# Altium schematic sheet STM32F103VE.SchDoc
size A4
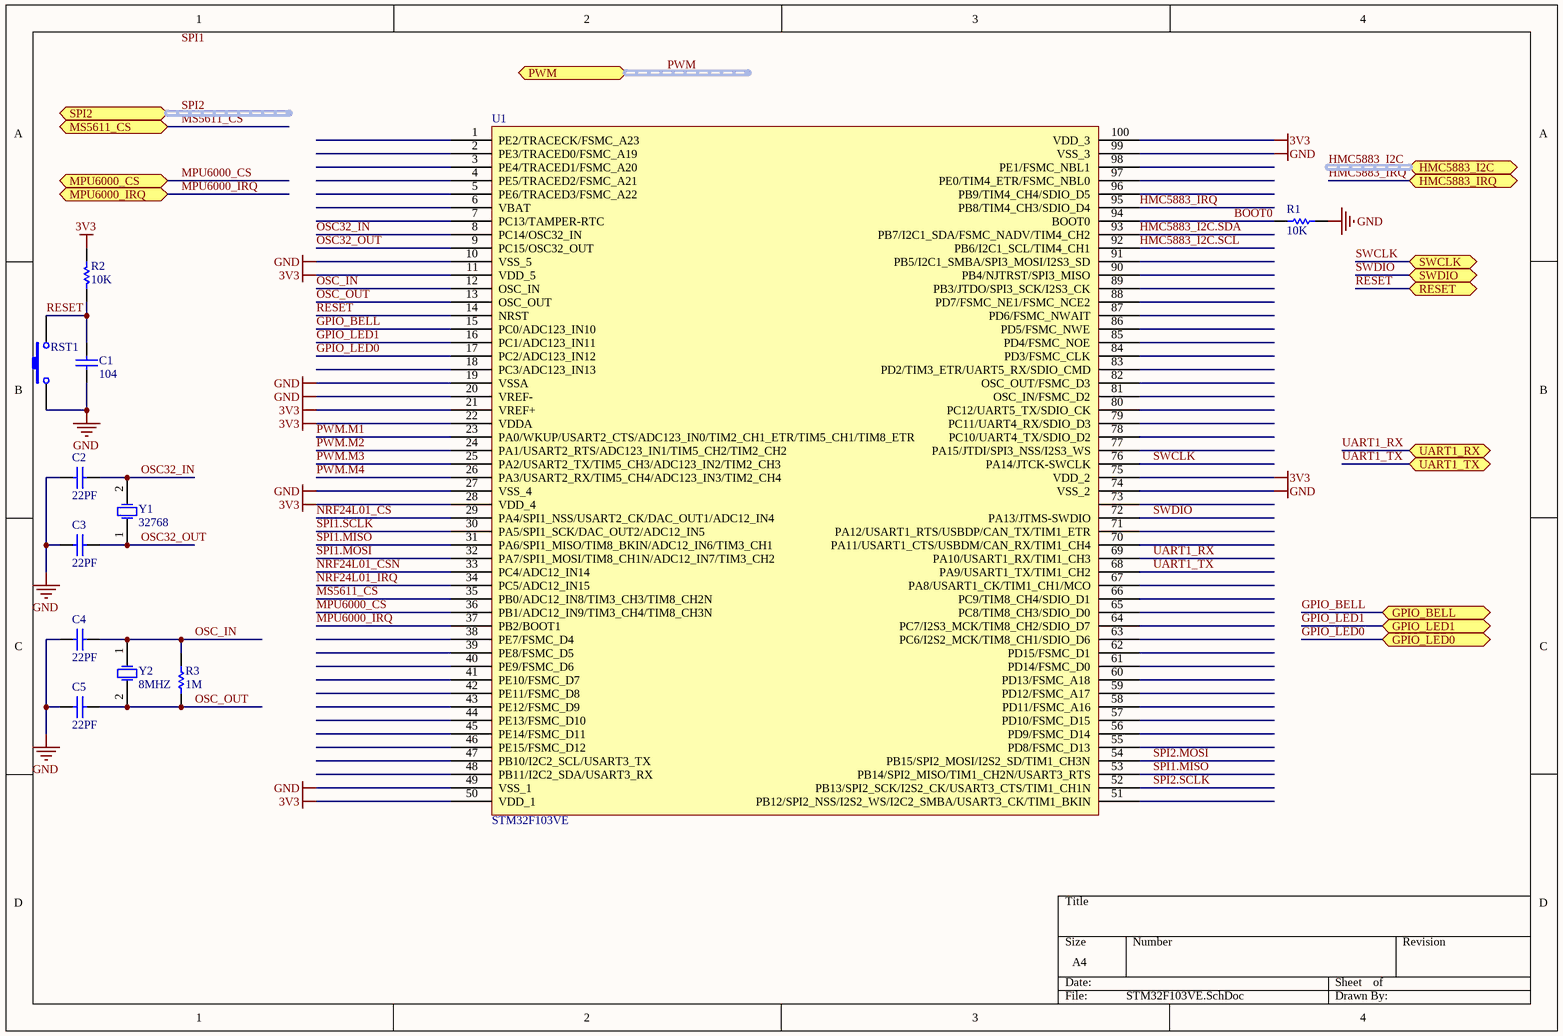
[diagram p0: STM32F103VE.SchDoc]

## Parts
C1  value 104  [RC0805]  (hidden comment: Cap)
C2  value 22PF  [RC0805]  (hidden comment: Cap)
C3  value 22PF  [RC0805]  (hidden comment: Cap)
C4  value 22PF  [RC0805]  (hidden comment: Cap)
C5  value 22PF  [RC0805]  (hidden comment: Cap)
R1  value 10K  [RC0805]  (hidden comment: Res1)
R2  value 10K  [RC0805]  (hidden comment: Res1)
R3  value 1M  [RC0805]  (hidden comment: Res1)
RST1  SW-PB  [KEY2*2(COMMON)]  (value not drawn)
U1  STM32F103VE
Y1  32768  [XTAL32]
Y2  8MHZ  [OSC]

## Ports
GPIO_BELL, GPIO_LED0, GPIO_LED1, HMC5883_I2C (harness HMC5883_I2C), HMC5883_IRQ, MPU6000_CS, MPU6000_IRQ, MS5611_CS, PWM (harness PWM), RESET, SPI2 (harness SPI2), SWCLK, SWDIO, UART1_RX, UART1_TX

## Nets
3V3: R2.2 U1.11(VDD_5) U1.21(VREF+) U1.22(VDDA) U1.28(VDD_4) U1.50(VDD_1) U1.75(VDD_2) U1.100(VDD_3)
GND: C1.2 C2.1 C3.1 C4.1 C5.1 R1.1 RST1.2 U1.10(VSS_5) U1.19(VSSA) U1.20(VREF-) U1.27(VSS_4) U1.49(VSS_1) U1.74(VSS_2) U1.99(VSS_3)
BOOT0: R1.2 U1.94(BOOT0)
GPIO_BELL: U1.15(PC0/ADC123_IN10) ; port GPIO_BELL
GPIO_LED0: U1.17(PC2/ADC123_IN12) ; port GPIO_LED0
GPIO_LED1: U1.16(PC1/ADC123_IN11) ; port GPIO_LED1
HMC5883_I2C.SCL: U1.92(PB6/I2C1_SCL/TIM4_CH1)
HMC5883_I2C.SDA: U1.93(PB7/I2C1_SDA/FSMC_NADV/TIM4_CH2)
HMC5883_IRQ: U1.95(PB8/TIM4_CH3/SDIO_D4) ; port HMC5883_IRQ
MPU6000_CS: U1.36(PB1/ADC12_IN9/TIM3_CH4/TIM8_CH3N) ; port MPU6000_CS
MPU6000_IRQ: U1.37(PB2/BOOT1) ; port MPU6000_IRQ
MS5611_CS: U1.35(PB0/ADC12_IN8/TIM3_CH3/TIM8_CH2N) ; port MS5611_CS
NRF24L01_CS: U1.29(PA4/SPI1_NSS/USART2_CK/DAC_OUT1/ADC12_IN4)
NRF24L01_CSN: U1.33(PC4/ADC12_IN14)
NRF24L01_IRQ: U1.34(PC5/ADC12_IN15)
OSC32_IN: C2.2 U1.8(PC14/OSC32_IN) Y1.2(OSC2)
OSC32_OUT: C3.2 U1.9(PC15/OSC32_OUT) Y1.1(OSC1)
OSC_IN: C4.2 R3.2 U1.12(OSC_IN) Y2.1(OSC1)
OSC_OUT: C5.2 R3.1 U1.13(OSC_OUT) Y2.2(OSC2)
PWM.M1: U1.23(PA0/WKUP/USART2_CTS/ADC123_IN0/TIM2_CH1_ETR/TIM5_CH1/TIM8_ETR)
PWM.M2: U1.24(PA1/USART2_RTS/ADC123_IN1/TIM5_CH2/TIM2_CH2)
PWM.M3: U1.25(PA2/USART2_TX/TIM5_CH3/ADC123_IN2/TIM2_CH3)
PWM.M4: U1.26(PA3/USART2_RX/TIM5_CH4/ADC123_IN3/TIM2_CH4)
RESET: C1.1 R2.1 RST1.1 U1.14(NRST) ; port RESET
SPI1.MISO: U1.31(PA6/SPI1_MISO/TIM8_BKIN/ADC12_IN6/TIM3_CH1) U1.53(PB14/SPI2_MISO/TIM1_CH2N/USART3_RTS)
SPI1.MOSI: U1.32(PA7/SPI1_MOSI/TIM8_CH1N/ADC12_IN7/TIM3_CH2)
SPI1.SCLK: U1.30(PA5/SPI1_SCK/DAC_OUT2/ADC12_IN5)
SPI2.MOSI: U1.54(PB15/SPI2_MOSI/I2S2_SD/TIM1_CH3N)
SPI2.SCLK: U1.52(PB13/SPI2_SCK/I2S2_CK/USART3_CTS/TIM1_CH1N)
SWCLK: U1.76(PA14/JTCK-SWCLK) ; port SWCLK
SWDIO: U1.72(PA13/JTMS-SWDIO) ; port SWDIO
UART1_RX: U1.69(PA10/USART1_RX/TIM1_CH3) ; port UART1_RX
UART1_TX: U1.68(PA9/USART1_TX/TIM1_CH2) ; port UART1_TX

Not connected (* = marked no-connect by the designer): U1 1(PE2/TRACECK/FSMC_A23) 2(PE3/TRACED0/FSMC_A19) 3(PE4/TRACED1/FSMC_A20) 4(PE5/TRACED2/FSMC_A21) 5(PE6/TRACED3/FSMC_A22) 6(VBAT) 7(PC13/TAMPER-RTC) 18(PC3/ADC123_IN13) 38(PE7/FSMC_D4) 39(PE8/FSMC_D5) 40(PE9/FSMC_D6) 41(PE10/FSMC_D7) 42(PE11/FSMC_D8) 43(PE12/FSMC_D9) 44(PE13/FSMC_D10) 45(PE14/FSMC_D11) 46(PE15/FSMC_D12) 47(PB10/I2C2_SCL/USART3_TX) 48(PB11/I2C2_SDA/USART3_RX) 51(PB12/SPI2_NSS/I2S2_WS/I2C2_SMBA/USART3_CK/TIM1_BKIN) 55(PD8/FSMC_D13) 56(PD9/FSMC_D14) 57(PD10/FSMC_D15) 58(PD11/FSMC_A16) 59(PD12/FSMC_A17) 60(PD13/FSMC_A18) 61(PD14/FSMC_D0) 62(PD15/FSMC_D1) 63(PC6/I2S2_MCK/TIM8_CH1/SDIO_D6) 64(PC7/I2S3_MCK/TIM8_CH2/SDIO_D7) 65(PC8/TIM8_CH3/SDIO_D0) 66(PC9/TIM8_CH4/SDIO_D1) 67(PA8/USART1_CK/TIM1_CH1/MCO) 70(PA11/USART1_CTS/USBDM/CAN_RX/TIM1_CH4) 71(PA12/USART1_RTS/USBDP/CAN_TX/TIM1_ETR) 73 77(PA15/JTDI/SPI3_NSS/I2S3_WS) 78(PC10/UART4_TX/SDIO_D2) 79(PC11/UART4_RX/SDIO_D3) 80(PC12/UART5_TX/SDIO_CK) 81(OSC_IN/FSMC_D2) 82(OSC_OUT/FSMC_D3) 83(PD2/TIM3_ETR/UART5_RX/SDIO_CMD) 84(PD3/FSMC_CLK) 85(PD4/FSMC_NOE) 86(PD5/FSMC_NWE) 87(PD6/FSMC_NWAIT) 88(PD7/FSMC_NE1/FSMC_NCE2) 89(PB3/JTDO/SPI3_SCK/I2S3_CK) 90(PB4/NJTRST/SPI3_MISO) 91(PB5/I2C1_SMBA/SPI3_MOSI/I2S3_SD) 96(PB9/TIM4_CH4/SDIO_D5) 97(PE0/TIM4_ETR/FSMC_NBL0) 98(PE1/FSMC_NBL1)

## Buses and harness runs
harness HMC5883_I2C = port HMC5883_I2C
harness PWM = port PWM
harness SPI2 = port SPI2

## Notes on the sheet
- Labels drawn without touching a wire or pin: SPI1

## Library data of the parts
C1-C5 = Cap: Capacitor; Published: 8-Jun-2000; LatestRevisionDate: 17-Jul-2002; LatestRevisionNote: Re-released for DXP Platform.; PackageReference: RAD-0.3; Publisher: Altium Limited; PackageDescription: Radial Cap, Thru-Hole; 2 Leads; 0.3 in Pin Spacing
R1-R3 = Res1: Resistor; Published: 8-Jun-2000; LatestRevisionDate: 17-Jul-2002; LatestRevisionNote: Re-released for DXP Platform.; PackageReference: AXIAL-0.3; Publisher: Altium Limited; PackageDescription: Axial Device, Thru-Hole; 2 Leads; 0.3 in Pin Spacing
RST1 = SW-PB: Switch; Published: 24-Mar-1999; LatestRevisionDate: 17-Jul-2002; LatestRevisionNote: Re-released for DXP Platform.; PackageReference: SPST-2; Publisher: Altium Limited; PackageDescription: Switch; 2 Leads
Y1 Y2 = XTAL: Crystal Oscillator; Published: 8-Jun-2000; LatestRevisionDate: 17-Jul-2002; LatestRevisionNote: Re-released for DXP Platform.; Publisher: Altium Limited
  Y1: PackageReference: R38; PackageDescription: Crystal, Thru-Hole; 2 Leads; Body 3.1 x 8.2 mm (Dia.xH)